# Altium schematic sheet 2020-09-12_14-06-071.schdoc
size 525 x 176 mm; SheetNumber: 1; SheetTotal: 1
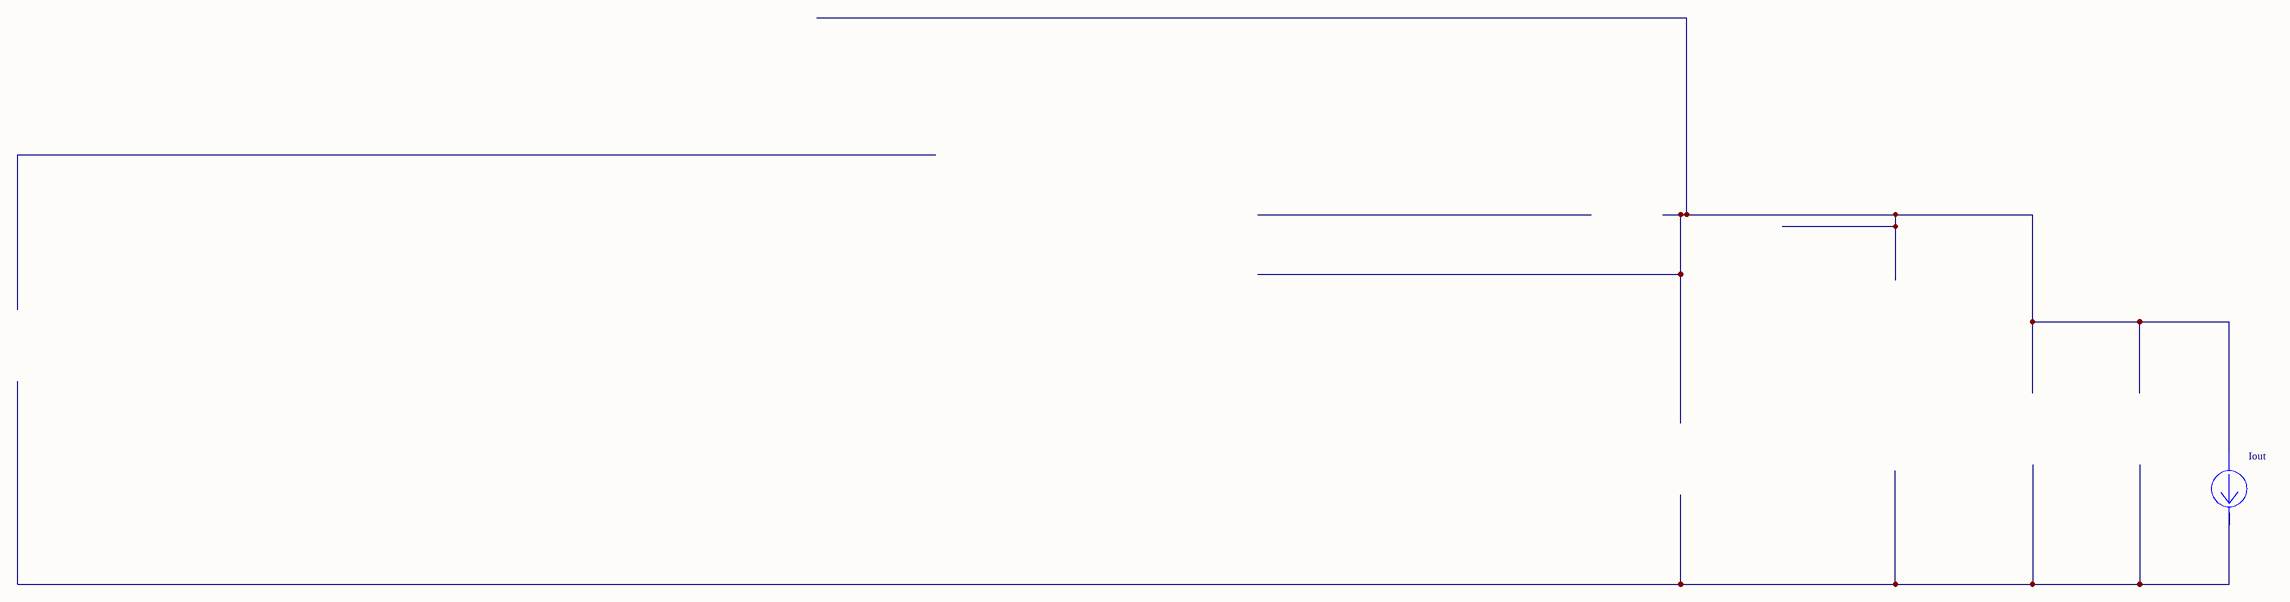
[diagram p0: 2020-09-12_14-06-071.schdoc]

## Parts
Iout  WB_CURRENT_LOAD  (value not drawn)

## Nets

Not connected (* = marked no-connect by the designer): Iout 1(+) 2(-)

## Library data of the parts
Iout = WB_CURRENT_LOAD: PackageReference: WB_CURRENT_LOAD; Manufacturer Part Number: WB_CURRENT_LOAD; Manufacturer Name: WB_CURRENT_LOAD; Value: N/A